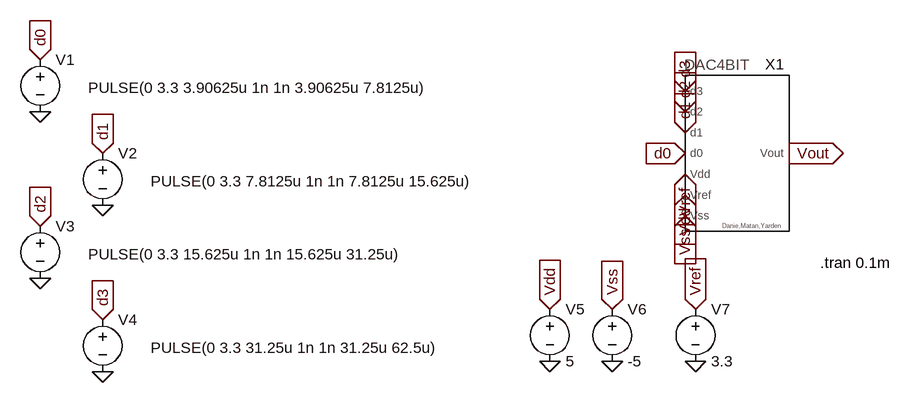
[diagram p0: schematic current_ladder_test.asc]
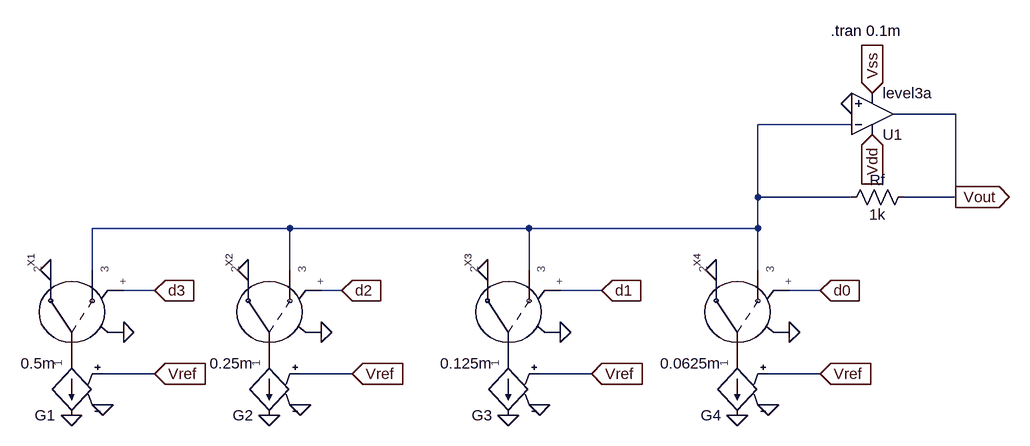
[diagram p1: sub-circuit current_ladder4.asc]
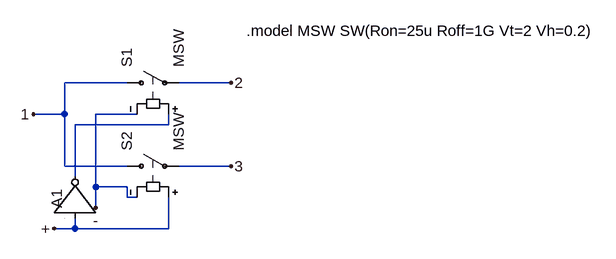
[diagram p2: sub-circuit spdt.asc]
current_ladder_test.asc, the LTspice schematic file:
Version 4
SHEET 1 1468 1048
FLAG 1136 432 d0
IOPIN 1136 432 In
FLAG 1136 400 d1
IOPIN 1136 400 In
FLAG 1136 368 d2
IOPIN 1136 368 In
FLAG 1136 336 d3
IOPIN 1136 336 In
FLAG 240 768 0
FLAG 144 624 0
FLAG 240 512 0
FLAG 144 368 0
FLAG 240 688 d3
IOPIN 240 688 In
FLAG 144 544 d2
IOPIN 144 544 In
FLAG 240 432 d1
IOPIN 240 432 In
FLAG 144 288 d0
IOPIN 144 288 In
FLAG 1136 464 Vref
IOPIN 1136 464 In
FLAG 1136 496 Vdd
IOPIN 1136 496 In
FLAG 1136 528 Vss
IOPIN 1136 528 In
FLAG 1296 432 Vout
IOPIN 1296 432 Out
FLAG 928 752 0
FLAG 1024 752 0
FLAG 1024 672 Vss
IOPIN 1024 672 In
FLAG 928 672 Vdd
IOPIN 928 672 In
FLAG 1152 752 0
FLAG 1152 672 Vref
IOPIN 1152 672 In
SYMBOL voltage 144 272 R0
WINDOW 3 74 59 Left 2
WINDOW 123 0 0 Left 0
WINDOW 39 0 0 Left 0
SYMATTR Value PULSE(0 3.3 3.90625u 1n 1n 3.90625u 7.8125u)
SYMATTR InstName V1
SYMBOL voltage 240 416 R0
WINDOW 3 74 59 Left 2
WINDOW 123 0 0 Left 0
WINDOW 39 0 0 Left 0
SYMATTR Value PULSE(0 3.3 7.8125u 1n 1n 7.8125u 15.625u)
SYMATTR InstName V2
SYMBOL voltage 144 528 R0
WINDOW 3 74 59 Left 2
WINDOW 123 0 0 Left 0
WINDOW 39 0 0 Left 0
SYMATTR Value PULSE(0 3.3 15.625u 1n 1n 15.625u 31.25u)
SYMATTR InstName V3
SYMBOL voltage 240 672 R0
WINDOW 3 74 59 Left 2
WINDOW 123 0 0 Left 0
WINDOW 39 0 0 Left 0
SYMATTR Value PULSE(0 3.3 31.25u 1n 1n 31.25u 62.5u)
SYMATTR InstName V4
SYMBOL voltage 928 656 R0
WINDOW 123 0 0 Left 0
WINDOW 39 0 0 Left 0
SYMATTR InstName V5
SYMATTR Value 5
SYMBOL voltage 1024 656 R0
WINDOW 123 0 0 Left 0
WINDOW 39 0 0 Left 0
SYMATTR InstName V6
SYMATTR Value -5
SYMBOL voltage 1152 656 R0
WINDOW 123 0 0 Left 0
WINDOW 39 0 0 Left 0
SYMATTR InstName V7
SYMATTR Value 3.3
SYMBOL current_ladder4 1216 432 R0
SYMATTR InstName X1
TEXT 1344 600 Left 2 !.tran 0.1m

current_ladder4.asc, the sub-circuit schematic file:
Version 4
SHEET 1 1256 1048
WIRE 1072 -304 976 -304
WIRE 912 -288 768 -288
WIRE 768 -176 768 -288
WIRE 912 -176 768 -176
WIRE 1072 -176 1072 -304
WIRE 1072 -176 992 -176
WIRE 48 -128 -256 -128
WIRE 416 -128 48 -128
WIRE 768 -128 768 -176
WIRE 768 -128 416 -128
WIRE -256 -64 -256 -128
WIRE 48 -64 48 -128
WIRE 416 -64 416 -128
WIRE 768 -64 768 -128
WIRE -160 -32 -208 -32
WIRE 128 -32 96 -32
WIRE 528 -32 464 -32
WIRE 864 -32 816 -32
WIRE -160 96 -240 96
WIRE 144 96 64 96
WIRE 512 96 432 96
WIRE 864 96 784 96
FLAG -320 -64 0
FLAG -16 -64 0
FLAG 352 -64 0
FLAG 704 -64 0
FLAG -208 32 0
FLAG 96 32 0
FLAG 464 32 0
FLAG 816 32 0
FLAG -288 160 0
FLAG 16 160 0
FLAG 384 160 0
FLAG 736 160 0
FLAG 912 -320 0
FLAG 944 -336 Vss
IOPIN 944 -336 In
FLAG 944 -272 Vdd
IOPIN 944 -272 In
FLAG 864 -32 d0
IOPIN 864 -32 In
FLAG 528 -32 d1
IOPIN 528 -32 In
FLAG 128 -32 d2
IOPIN 128 -32 In
FLAG -160 -32 d3
IOPIN -160 -32 In
FLAG 1072 -176 Vout
IOPIN 1072 -176 Out
FLAG 432 144 0
FLAG 784 144 0
FLAG 864 96 Vref
IOPIN 864 96 In
FLAG 512 96 Vref
IOPIN 512 96 In
FLAG 64 144 0
FLAG 144 96 Vref
IOPIN 144 96 In
FLAG -240 144 0
FLAG -160 96 Vref
IOPIN -160 96 In
SYMBOL SPDT -288 32 R270
SYMATTR InstName X1
SYMBOL SPDT 16 32 R270
SYMATTR InstName X2
SYMBOL SPDT 384 32 R270
SYMATTR InstName X3
SYMBOL SPDT 736 32 R270
SYMATTR InstName X4
SYMBOL res 1008 -192 R90
WINDOW 0 5 56 VBottom 2
WINDOW 3 27 56 VTop 2
SYMATTR InstName Rf
SYMATTR Value 1k
SYMBOL g2 -288 176 R180
SYMATTR InstName G1
SYMATTR Value 0.5m
SYMBOL g2 16 176 R180
SYMATTR InstName G2
SYMATTR Value 0.25m
SYMBOL g2 384 176 R180
SYMATTR InstName G3
SYMATTR Value 0.125m
SYMBOL g2 736 176 R180
SYMATTR InstName G4
SYMATTR Value 0.0625m
SYMBOL OpAmps\\UniversalOpAmp3 944 -304 M180
SYMATTR InstName U1
TEXT 880 -432 Left 2 !.tran 0.1m

spdt.asc, the sub-circuit schematic file:
Version 4
SHEET 1 932 680
WIRE 144 96 48 96
WIRE 304 96 224 96
WIRE 48 144 48 96
WIRE 48 144 0 144
WIRE 160 144 96 144
WIRE 208 160 208 144
WIRE 208 160 64 160
WIRE 48 224 48 144
WIRE 144 224 48 224
WIRE 304 224 224 224
WIRE 64 240 64 160
WIRE 96 256 96 144
WIRE 144 256 96 256
WIRE 144 272 144 256
WIRE 160 272 144 272
WIRE 96 288 96 256
WIRE 64 320 64 304
WIRE 64 320 32 320
WIRE 208 320 208 272
WIRE 208 320 64 320
FLAG 0 144 1
FLAG 304 96 2
FLAG 304 224 3
FLAG 32 320 +
FLAG 96 288 -
SYMBOL sw 128 96 R270
SYMATTR InstName S1
SYMATTR Value MSW
SYMBOL sw 128 224 R270
SYMATTR InstName S2
SYMATTR Value MSW
SYMBOL Digital\\inv 128 304 M270
WINDOW 3 8 60 Invisible 2
WINDOW 0 15 92 Left 2
SYMATTR Value td=10n Vhigh=5
SYMATTR InstName A1
TEXT 328 16 Left 2 !.model MSW SW(Ron=25u Roff=1G Vt=2 Vh=0.2)

The netlist it stands for:
* current_ladder_test.asc
V1 d0 0 PULSE(0 3.3 3.90625u 1n 1n 3.90625u 7.8125u)
V2 d1 0 PULSE(0 3.3 7.8125u 1n 1n 7.8125u 15.625u)
V3 d2 0 PULSE(0 3.3 15.625u 1n 1n 15.625u 31.25u)
V4 d3 0 PULSE(0 3.3 31.25u 1n 1n 31.25u 62.5u)
V5 Vdd 0 5
V6 Vss 0 -5
V7 Vref 0 3.3
XX1 d0 d1 d2 d3 Vref Vdd Vss Vout current_ladder4

* block symbol definitions
.subckt current_ladder4 d0 d1 d2 d3 Vdd Vref Vss Vout
XX1 P001 0 N001 d3 0 spdt
XX2 P002 0 N001 d2 0 spdt
XX3 P003 0 N001 d1 0 spdt
XX4 P004 0 N001 d0 0 spdt
Rf Vout N001 1k
G1 P001 0 Vref 0 0.5m
G2 P002 0 Vref 0 0.25m
G3 P003 0 Vref 0 0.125m
G4 P004 0 Vref 0 0.0625m
XU1 0 N001 Vdd Vss Vout level3a  ; pins In+ In- V+ V- OUT
.tran 0.1m
.ends current_ladder4

.subckt spdt 1 2 3 + -
S1 1 2 N001 - MSW
S2 1 3 + - MSW
A1 + 0 0 0 0 N001 0 0 BUF td=10n Vhigh=5
.model MSW SW(Ron=25u Roff=1G Vt=2 Vh=0.2)
.ends spdt

.tran 0.1m
.backanno
.end

* Results of the author's LTspice run, read from the files saved beside the schematic
* Operating Point, zero values left out:
*   V(vdd) = 5 V
*   V(vss) = -5 V
*   V(vref) = 3.3 V
*   V(vout) = 848 nV
*   I(V6) = 406.2 µA
*   I(V7) = -406.2 µA
*   Ix(x1:VDD) = 406.2 µA
*   Ix(x1:VSS) = -406.2 µA
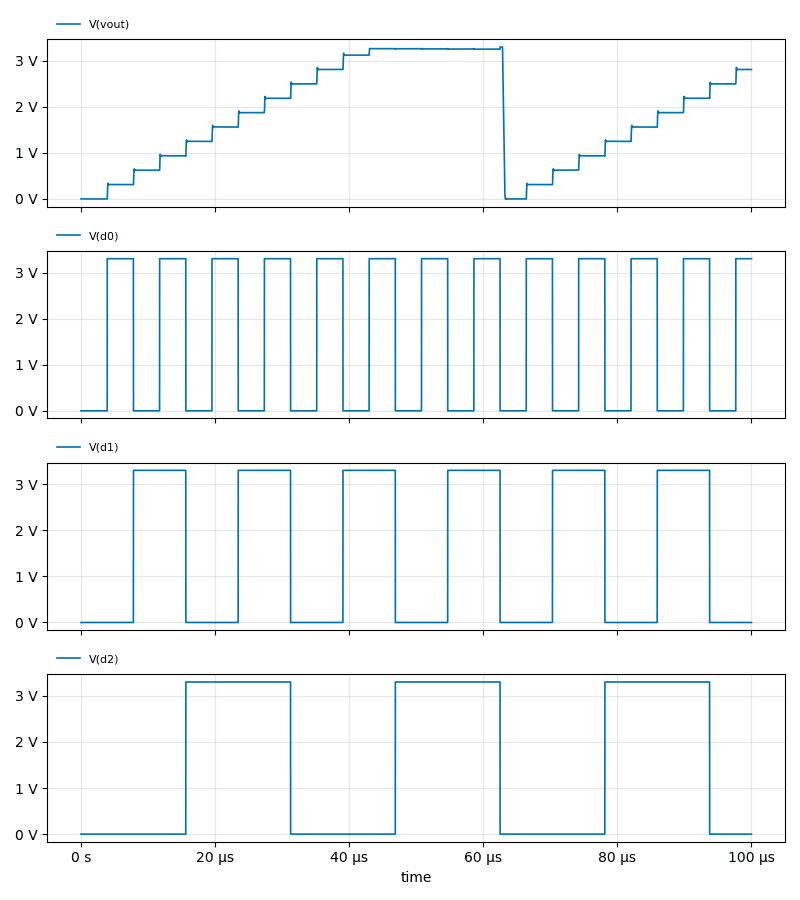
[diagram p3: Transient Analysis of current_ladder_test.asc, plotted from the saved traces]
* Transient Analysis, 1 run:
*   V(vout): min -5.174 mV, max 3.3 V, average 1.829 V, rms 2.134 V, last 2.812 V
*   V(d0): min 0 V, max 3.3 V, average 1.625 V, rms 2.315 V, last 3.3 V
*   V(d1): min 0 V, max 3.3 V, average 1.547 V, rms 2.259 V, last 0 V
*   V(d2): min 0 V, max 3.3 V, average 1.547 V, rms 2.259 V, last 0 V